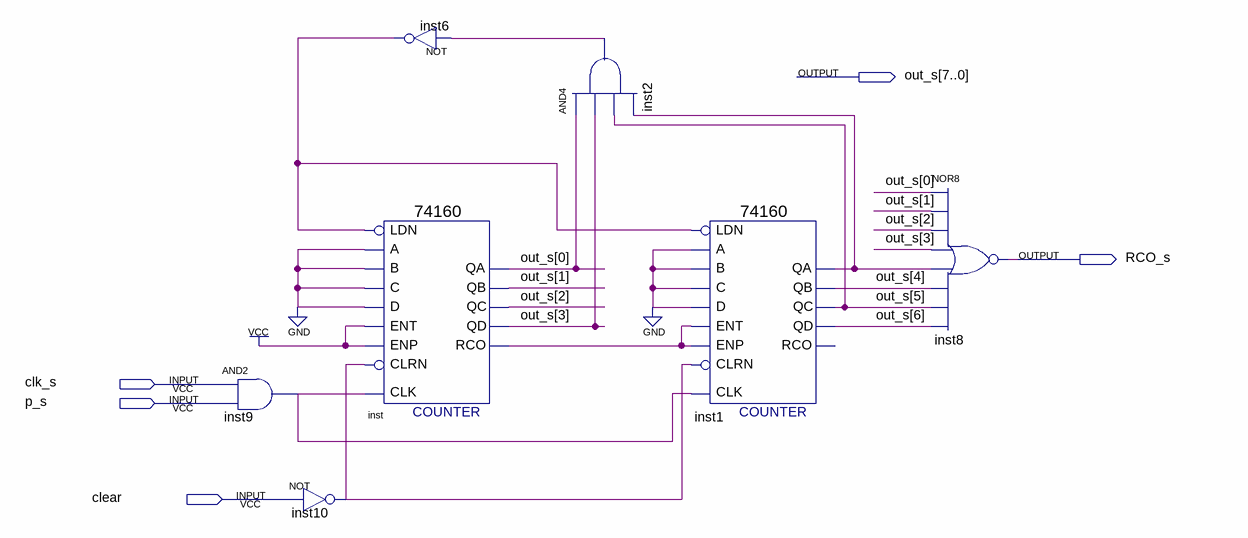
[diagram p0: schematic sheet]
// Quartus schematic out_s.bdf as structural Verilog: 7 symbols, 5 pins
module out_s (
  input  clk_s,
  input  p_s,
  input  clear,
  output [7:0] out_s,
  output RCO_s
);

  wire inst1_qd, inst2_out, inst6_out, inst9_out, inst10_out, inst_rco;

  and inst9 (inst9_out, clk_s, p_s);
  not inst10 (inst10_out, clear);
  \74160  inst (
    .CLK(inst9_out), .ENT(1'b1), .A(1'b0), .B(1'b0), .C(1'b0), .D(1'b0), .LDN(inst6_out), .ENP(1'b1),
    .CLRN(inst10_out), .QD(out_s[3]), .QA(out_s[0]), .QB(out_s[1]), .QC(out_s[2]), .RCO(inst_rco));
  not inst6 (inst6_out, inst2_out);
  and inst2 (inst2_out, out_s[0], out_s[3], out_s[6], out_s[4]);
  \74160  inst1 (
    .CLK(inst9_out), .ENT(inst_rco), .A(1'b0), .B(1'b0), .C(1'b0), .D(1'b0), .LDN(inst6_out), .ENP(inst_rco),
    .CLRN(inst10_out), .QD(inst1_qd), .QA(out_s[4]), .QB(out_s[5]), .QC(out_s[6]));  // open: RCO
  nor inst8 (RCO_s, out_s[0], out_s[1], out_s[2], out_s[3], out_s[4], out_s[5], out_s[6], inst1_qd);
endmodule
